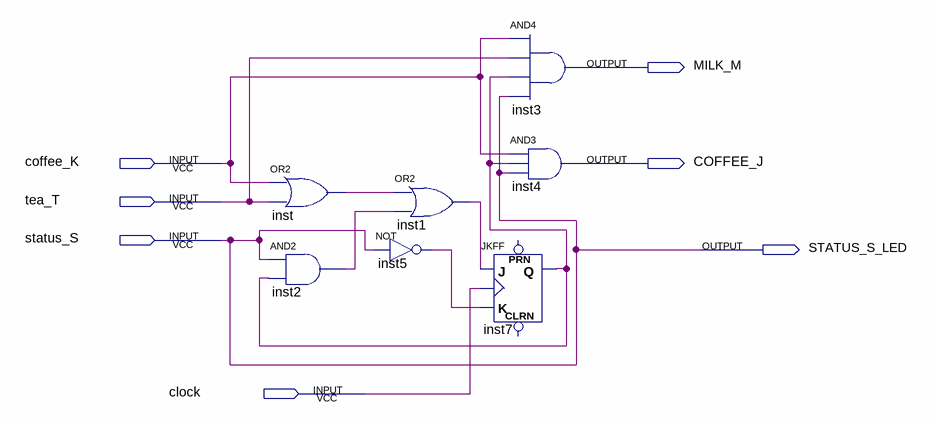
[diagram p0: schematic sheet]
// Quartus schematic drinkdispenser.bdf as structural Verilog: 7 symbols, 7 pins
module drinkdispenser (
  input  coffee_K,
  input  tea_T,
  input  status_S,
  input  clock,
  output MILK_M,
  output COFFEE_J,
  output STATUS_S_LED
);

  wire inst1_out, inst2_out, inst5_out, inst7_q, inst_out;

  or inst (inst_out, coffee_K, tea_T);
  and inst2 (inst2_out, status_S, inst7_q);
  or inst1 (inst1_out, inst_out, inst2_out);
  not inst5 (inst5_out, status_S);
  JKFF inst7 (.K(inst5_out), .J(inst1_out), .CLK(clock), .Q(inst7_q));  // open: PRN, CLRN
  and inst3 (MILK_M, coffee_K, tea_T, inst7_q, status_S);
  and inst4 (COFFEE_J, coffee_K, inst7_q, status_S);

  assign STATUS_S_LED = status_S;
endmodule
